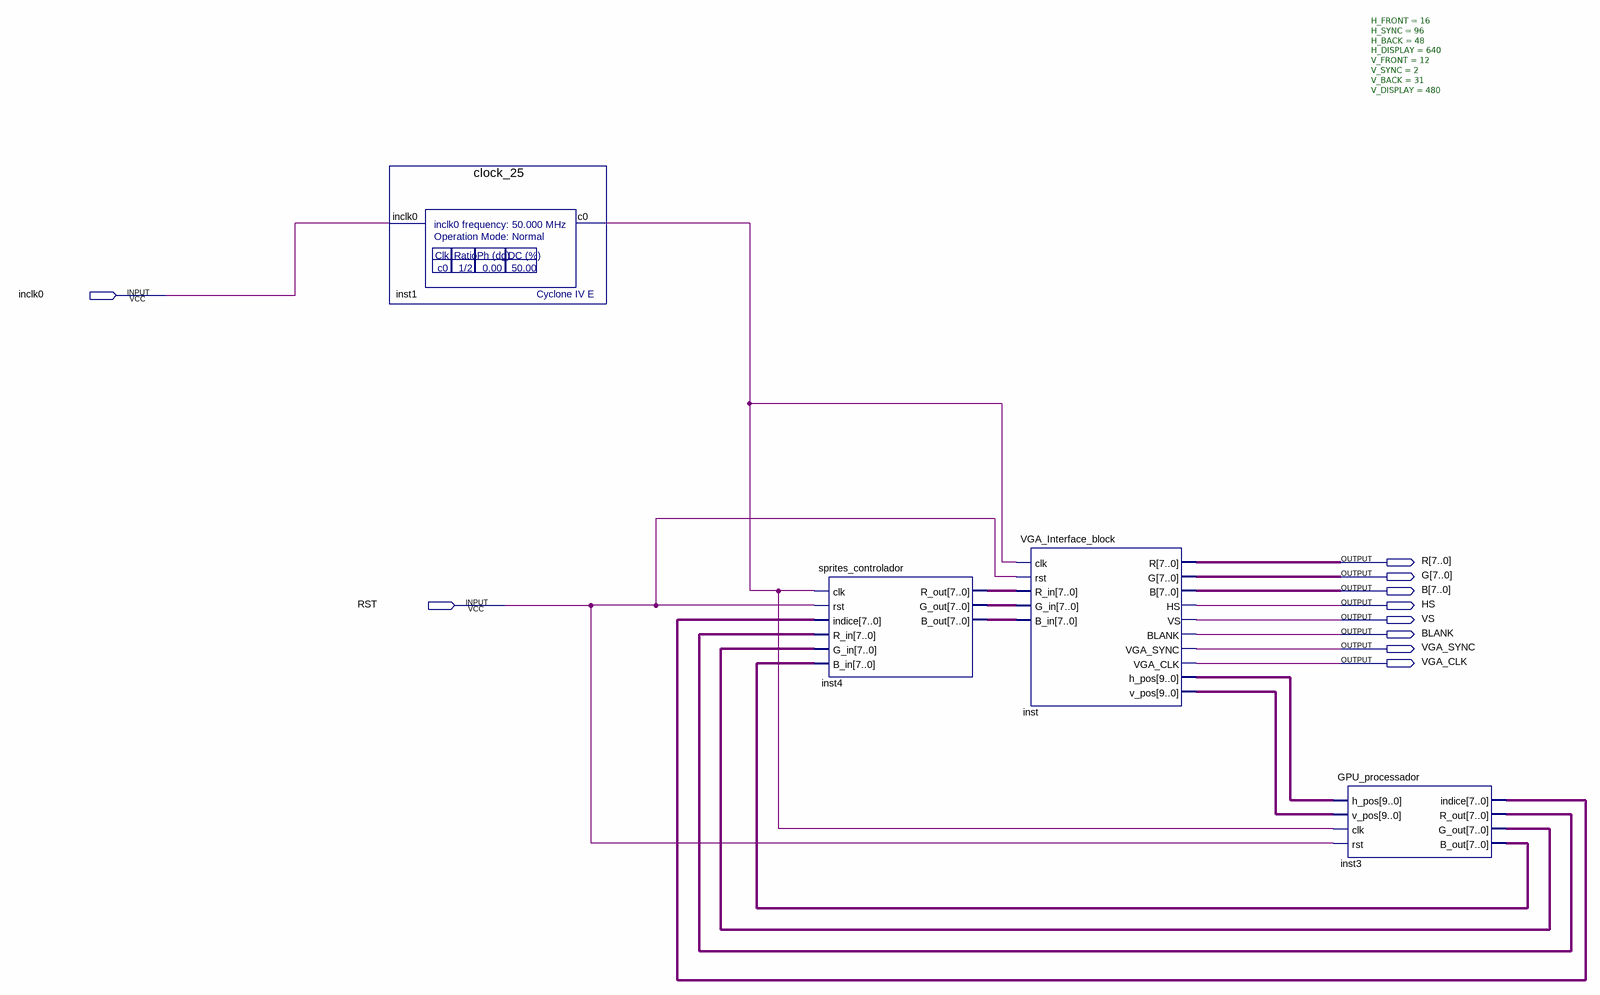
[diagram p0: schematic sheet]
// Quartus schematic VGA_Interface.bdf as structural Verilog: 4 symbols, 10 pins
module VGA_Interface (
  input  inclk0,
  input  RST,
  output [7:0] R,
  output [7:0] G,
  output [7:0] B,
  output HS,
  output VS,
  output BLANK,
  output VGA_SYNC,
  output VGA_CLK
);

  wire inst1_c0;
  wire [7:0] inst3_b_out, inst3_g_out, inst3_indice, inst3_r_out, inst4_b_out, inst4_g_out, inst4_r_out;
  wire [9:0] inst_h_pos, inst_v_pos;

  clock_25 inst1 (.inclk0(inclk0), .c0(inst1_c0));
  sprites_controlador inst4 (
    .clk(inst1_c0), .rst(RST), .indice(inst3_indice), .R_in(inst3_r_out), .G_in(inst3_g_out),
    .B_in(inst3_b_out), .R_out(inst4_r_out), .G_out(inst4_g_out), .B_out(inst4_b_out));
  VGA_Interface_block #(.H_FRONT(16), .H_SYNC(96), .H_BACK(48), .H_DISPLAY(640), .V_FRONT(12), .V_SYNC(2), .V_BACK(31), .V_DISPLAY(480)) inst (
    .clk(inst1_c0), .rst(RST), .R_in(inst4_r_out), .G_in(inst4_g_out), .B_in(inst4_b_out), .R(R), .G(G),
    .B(B), .HS(HS), .VS(VS), .BLANK(BLANK), .VGA_SYNC(VGA_SYNC), .VGA_CLK(VGA_CLK), .h_pos(inst_h_pos),
    .v_pos(inst_v_pos));
  GPU_processador inst3 (
    .h_pos(inst_h_pos), .v_pos(inst_v_pos), .clk(inst1_c0), .rst(RST), .indice(inst3_indice),
    .R_out(inst3_r_out), .G_out(inst3_g_out), .B_out(inst3_b_out));
endmodule
